# Altium project Rev4.PrjPcb
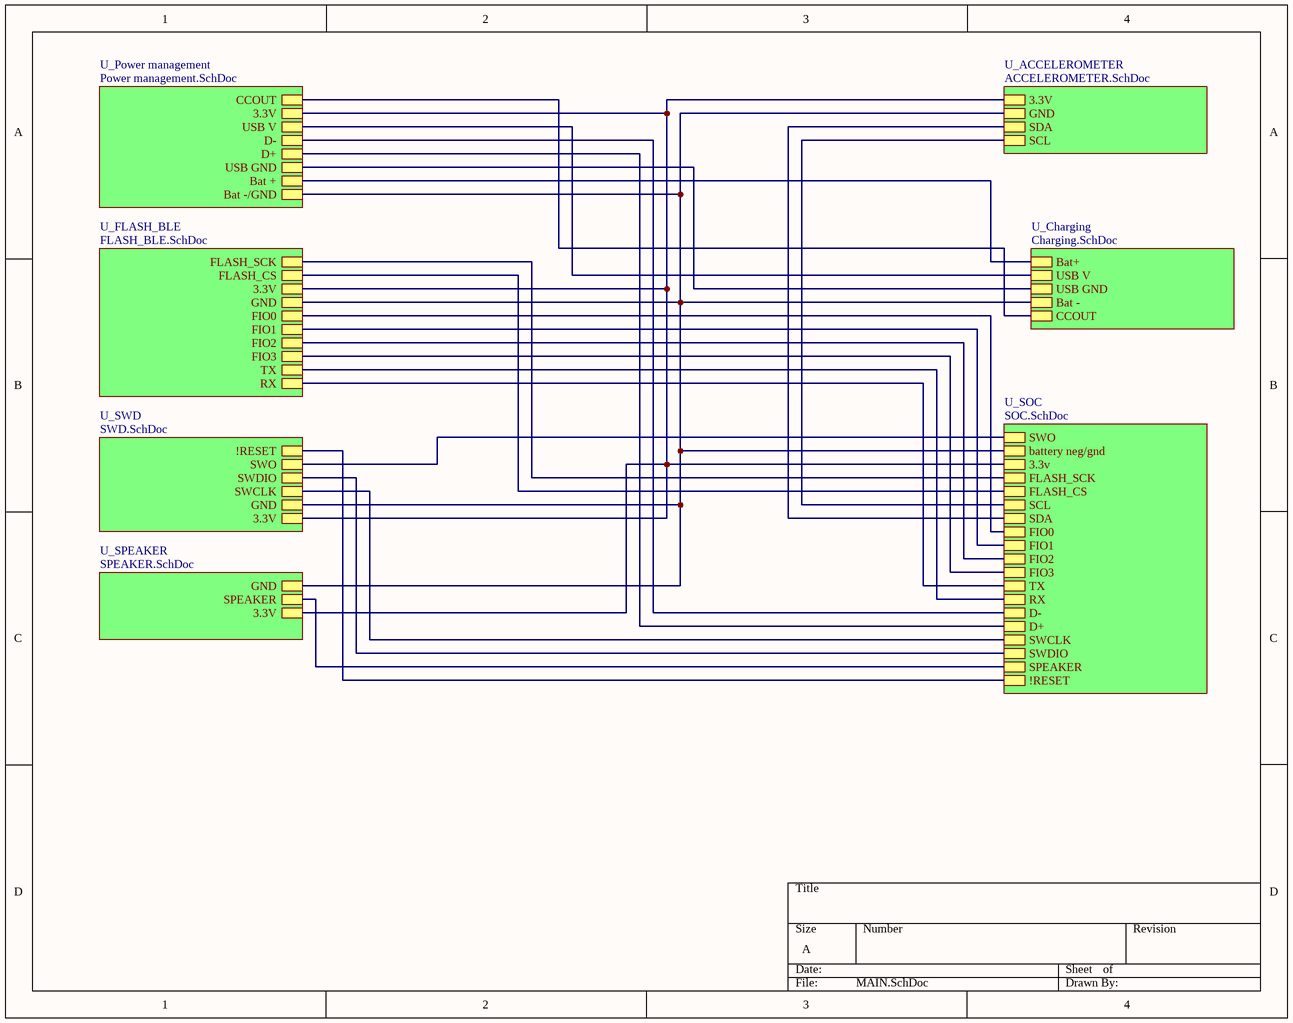
[diagram p0: MAIN.SchDoc]
8 sheets, 49 parts. Net scope: hierarchical (ports join the sheet entries above them; power ports are global).
Board file: PCB1.PcbDoc
Sheets:
  MAIN.SchDoc
    U_ACCELEROMETER = ACCELEROMETER.SchDoc
    U_SOC = SOC.SchDoc
    U_SWD = SWD.SchDoc
    U_SPEAKER = SPEAKER.SchDoc
    U_FLASH_BLE = FLASH_BLE.SchDoc
    U_Charging = Charging.SchDoc
    U_Power management = Power management.SchDoc

## Sheet MAIN.SchDoc
size A; SheetNumber: 1; SheetTotal: 8

### Sub-sheets
U_ACCELEROMETER = ACCELEROMETER.SchDoc: 3.3V, GND, SDA, SCL
U_Charging = Charging.SchDoc: Bat+, USB V, USB GND, Bat -, CCOUT
U_FLASH_BLE = FLASH_BLE.SchDoc: FLASH_SCK, FLASH_CS, 3.3V, GND, FIO0, FIO1, FIO2, FIO3, TX, RX
U_Power management = Power management.SchDoc: USB V, D-, D+, USB GND, Bat +, Bat -/GND, 3.3V, CCOUT
U_SOC = SOC.SchDoc: SWO, battery neg/gnd, 3.3v, FLASH_SCK, FLASH_CS, SCL, SDA, FIO0, FIO1, FIO2, FIO3, TX, RX, D-, D+, SWCLK, SWDIO, SPEAKER, !RESET
U_SPEAKER = SPEAKER.SchDoc: GND, SPEAKER, 3.3V
U_SWD = SWD.SchDoc: !RESET, SWO, SWDIO, SWCLK, GND, 3.3V

### Nets
Net3.3v_1: sheet U_Charging/CCOUT, sheet U_Power management/CCOUT
Net3.3v_3: sheet U_ACCELEROMETER/3.3V, sheet U_SOC/3.3v, sheet U_SWD/3.3V, sheet U_SPEAKER/3.3V, sheet U_FLASH_BLE/3.3V, sheet U_Power management/3.3V
Net3.3v_4: sheet U_ACCELEROMETER/GND, sheet U_SOC/battery neg/gnd, sheet U_SWD/GND, sheet U_SPEAKER/GND, sheet U_FLASH_BLE/GND, sheet U_Charging/USB GND, sheet U_Charging/Bat -, sheet U_Power management/USB GND, sheet U_Power management/Bat -/GND
NetAccelerometer?_23: sheet U_ACCELEROMETER/SCL, sheet U_SOC/SCL
NetAccelerometer?_24: sheet U_ACCELEROMETER/SDA, sheet U_SOC/SDA
NetBattery_Terminal_1: sheet U_Charging/Bat+, sheet U_Power management/Bat +
NetBLE_2: sheet U_SOC/RX, sheet U_FLASH_BLE/TX
NetBLE_4: sheet U_SOC/TX, sheet U_FLASH_BLE/RX
NetC11_2: sheet U_SOC/!RESET, sheet U_SWD/!RESET
NetCCC3_1: sheet U_Charging/USB V, sheet U_Power management/USB V
NetJ1_2: sheet U_SOC/SWDIO, sheet U_SWD/SWDIO
NetJ1_4: sheet U_SOC/SWCLK, sheet U_SWD/SWCLK
NetJ1_6: sheet U_SOC/SWO, sheet U_SWD/SWO
NetM4_17: sheet U_SOC/FIO0, sheet U_FLASH_BLE/FIO0
NetM4_18: sheet U_SOC/FIO1, sheet U_FLASH_BLE/FIO1
NetM4_19: sheet U_SOC/FIO2, sheet U_FLASH_BLE/FIO2
NetM4_20: sheet U_SOC/FIO3, sheet U_FLASH_BLE/FIO3
NetM4_23: sheet U_SOC/FLASH_SCK, sheet U_FLASH_BLE/FLASH_SCK
NetM4_24: sheet U_SOC/FLASH_CS, sheet U_FLASH_BLE/FLASH_CS
NetM4_25: sheet U_SOC/SPEAKER, sheet U_SPEAKER/SPEAKER
NetM4_45: sheet U_SOC/D-, sheet U_Power management/D-
NetM4_46: sheet U_SOC/D+, sheet U_Power management/D+

## Sheet ACCELEROMETER.SchDoc
size A; SheetNumber: 5; SheetTotal: 8
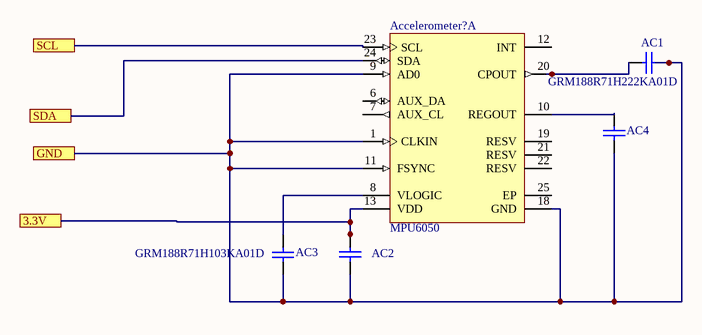
[diagram p1: ACCELEROMETER.SchDoc]

### Parts
AC1  GRM188R71H222KA01D  [CAPC1608X90X35NL10T15]
AC2  (no value)  [CAPC0805(2012)145_L]
AC3  GRM188R71H103KA01D  [CAPC1608X90X35ML10T15]
AC4  (no value)  [CAPC0805(2012)145_L]
Accelerometer?  MPU6050  [INSE-QFN-24_V]  (part A of 2)

### Ports
3.3V, GND, SCL, SDA

### Nets
Net3.3v_3: AC2.2 Accelerometer?.13(VDD) ; port 3.3V
Net3.3v_4: AC1.2 AC2.1 AC3.1 AC4.1 Accelerometer?.1(CLKIN) Accelerometer?.9(AD0) Accelerometer?.11(FSYNC) Accelerometer?.18(GND) ; port GND
NetAC1_1: AC1.1 Accelerometer?.20(CPOUT)
NetAC3_2: AC3.2 Accelerometer?.8(VLOGIC)
NetAC4_2: AC4.2 Accelerometer?.10(REGOUT)
NetAccelerometer?_23: Accelerometer?.23(SCL) ; port SCL
NetAccelerometer?_24: Accelerometer?.24(SDA) ; port SDA

Not connected (* = marked no-connect by the designer): Accelerometer? 6(AUX_DA) 7(AUX_CL) 12(INT) 19(RESV) 21(RESV) 22(RESV) 25(EP)

### Library data of the parts
AC1 = CMP-1662-00006-4: Chip Capacitor, 2.2 nF, +/- 10%, 50 V, -55 to 125 degC, 0603 (1608 Metric), RoHS, Tape and Reel; Manufacturer: Murata; Voltage Rating: 50 V; Pins: 2; Mount: Surface Mount; Max Operating Temperature: 125 degC; ComponentLink1Description: Manufacturer URL; RoHSCompliant: true; PackageDescription: 2-Pin Surface Mount Device, Body 1.6 x 0.8 mm; ComponentLink2URL: http://search.murata.co.jp/Ceramy/image/img/A01X/G101/ENG/GRM188R71H222KA01-01.pdf; PackageReference: 0603; Height: 0.8 mm; Lead Pitch: 4 mm; Packaging: Tape and Reel; DatasheetVersion: 02/2016; Mounting Technology: Surface Mount; ComponentLink2Description: Datasheet; Min Operating Temperature: -55 degC; Length: 1.6 mm; REACH SVHC: No SVHC; Package Quantity: 4000; ComponentLink1URL: http://www.murata.com/
AC2 AC4 = CMP-1036-04761-1: CAP 1uF 50V ±10% 0805 (2012 Metric) Thickness 1.45mm SMD; Tolerance: Â±10%; Case-EIA: 0805; Case-Metric: 2012; Technology: SMT; Value: 1uF; Max Thickness: 1.45 mm; Rated Voltage: 50 V
AC3 = CMP-2100-03642-1: Chip Capacitor, 10 nF, +/- 10%, 50 V, -55 to 125 degC, 0603 (1608 Metric), RoHS, Tape and Reel; Manufacturer: Murata; Insulation Resistance: 10GR; Dielectric: X7R; Voltage Rating: 50V; Capacitance: 10nF; Dielectric Material: Ceramic; Package Quantity: 1; Lead Free: LeadFree; Case/Package: 0603; Termination: SMD/SMT; REACH SVHC: Unknown; Manufacturer URL: http://www.murata.com/; Datasheet URL: http://search.murata.co.jp/Ceramy/image/img/A01X/G101/ENG/GRM188R71H103KA01-01.pdf; Mount: SurfaceMount; Datasheet Version: 42401.0; Number of Pins: 2; Length: 1.6mm; Voltage: 50V; Depth: 0.8mm; Tolerance: 10%; Min Operating Temperature: -55degC; Voltage Rating (DC): 50V; Max Operating Temperature: 125degC; Package Description: 2-Pin Surface Mount Device, Body 1.6 x 0.8 mm; RoHSCompliant: True; Case Code (Imperial): 0603; Width: 0.031inch; Case Code (Metric): 1608; Height: 0.8mm; Package Reference: 0603; Packaging: TapeandReel; Thickness: 0.035inch; Material: Ceramic
Accelerometer? = CMP-1753-00002-1: 3-Axis Gyroscope, 3-Axis Accelerometer / , 2.375 to 3.46 V, -40 to 105 degC, 24-Pin QFN, RoHS, Tape and Reel; Resistance: 5.6 kohm; Tolerance: 1%; Voltage Rating: 75 V; Power Rating: 100 mW; ComponentLink1Description: Manufacturer URL; Mount: Surface Mount; Max Operating Temperature: 155degC; Package Quantity: 5000; ComponentLink2Description: Datasheet; Pins: 2; Packaging: Tape and Reel; Case Code (Imperial): 0603; PackageReference: QFN-24; ComponentLink2URL: https://datasheet.ciiva.com/1513/1788002-1513632.pdf; Radiation Hardening: No; ComponentLink1URL: http://www.invensense.com/; PackageDescription: 24-Pin Quad Flat No-lead Package, Body 4 x 4 mm, Pitch 0.5 mm; Height: 0.45 mm; Case/Package: 0603; Case Code (Metric): 1608; REACH SVHC: Yes; Min Operating Temperature: -55degC; DatasheetVersion: Rev. 3.4, 08/2013; Width: 0.8 mm; RoHSCompliant: True; Length: 1.6 mm

## Sheet SOC.SchDoc
size A; SheetNumber: 2; SheetTotal: 8
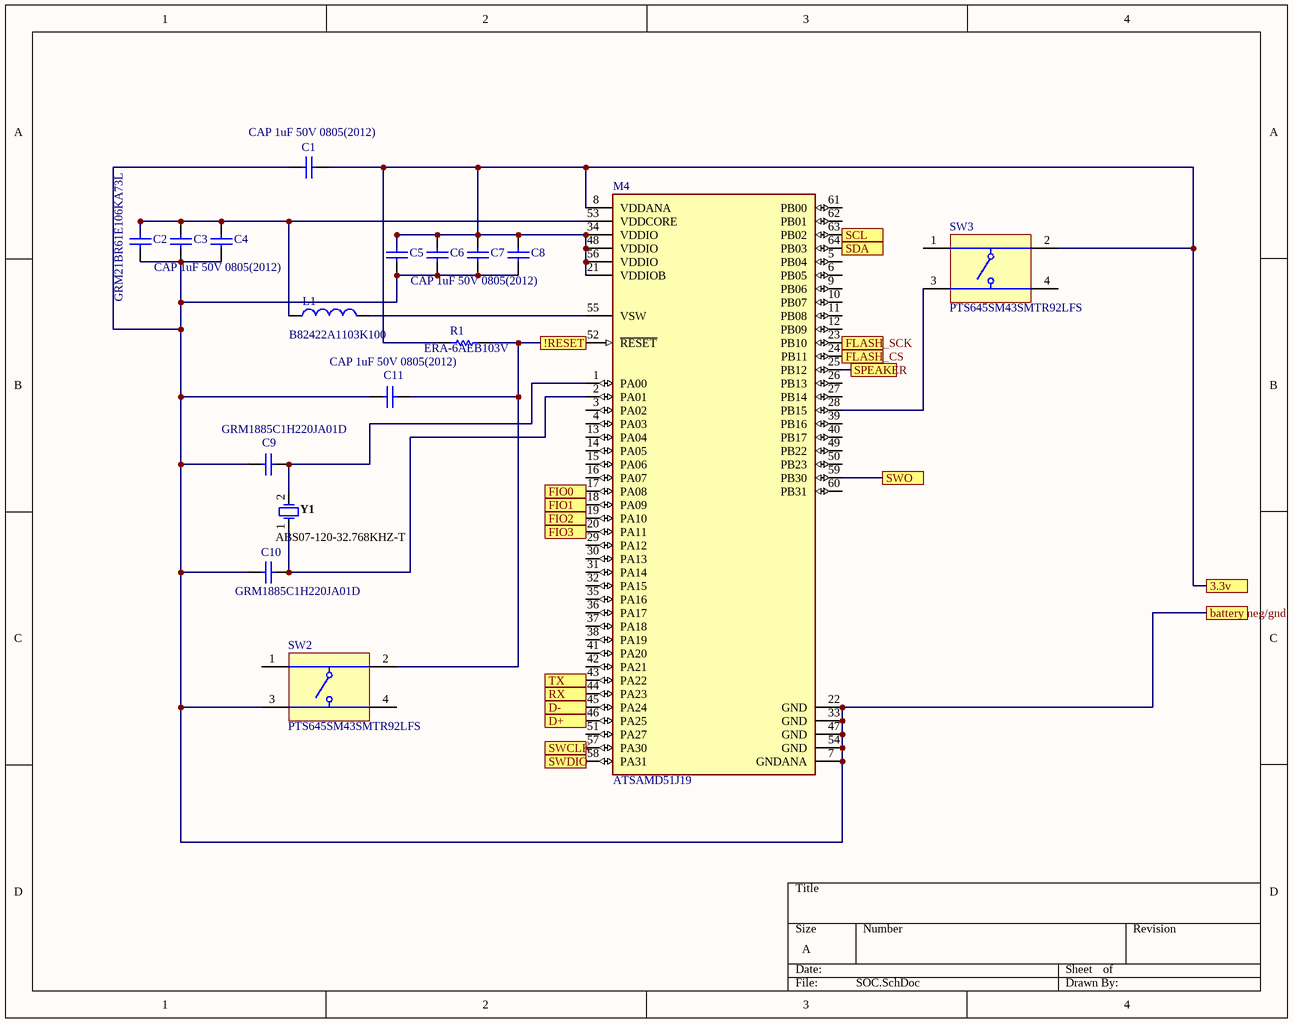
[diagram p2: SOC.SchDoc]

### Parts
C1  CAP 1uF 50V 0805(2012)  [CAPC0805(2012)145_L]
C2  GRM21BR61E106KA73L  [CAPC2013X135X45ML10T25]
C3  (no value)  [CAPC0805(2012)145_L]
C4  CAP 1uF 50V 0805(2012)  [CAPC0805(2012)145_L]
C5  (no value)  [CAPC0805(2012)145_L]
C6  (no value)  [CAPC0805(2012)145_L]
C7  (no value)  [CAPC0805(2012)145_L]
C8  CAP 1uF 50V 0805(2012)  [CAPC0805(2012)145_L]
C9  GRM1885C1H220JA01D  [CAPC1608X90X35ML10T15]
C10  GRM1885C1H220JA01D  [CAPC1608X90X35ML10T15]
C11  CAP 1uF 50V 0805(2012)  [CAPC0805(2012)145_L]
L1  B82422A1103K100  [TDK-B82422A1103K100_V]
M4  ATSAMD51J19  [FP-C04-085-MFG]
R1  ERA-6AEB103V  [RESC2013X60X40LL20T25_A]
SW2  PTS645SM43SMTR92LFS  [ITT-PTS645S-4_V]
SW3  PTS645SM43SMTR92LFS  [ITT-PTS645S-4_V]
Y1  ABS07-120-32.768KHZ-T  [ABRA-ABS07_A_V]

### Ports
3.3v, !RESET, battery neg/gnd, D+, D-, FIO0, FIO1, FIO2, FIO3, FLASH_CS, FLASH_SCK, RX, SCL, SDA, SPEAKER, SWCLK, SWDIO, SWO, TX

### Nets
Net3.3v_3: C1.2 C5.2 C6.2 C7.2 C8.2 M4.8(VDDANA) M4.21(VDDIOB) M4.34(VDDIO) M4.48(VDDIO) M4.56(VDDIO) R1.1 SW3.2 ; port 3.3v
Net3.3v_4: C1.1 C2.1 C3.1 C4.1 C5.1 C6.1 C7.1 C8.1 C9.1 C10.1 C11.1 M4.7(GNDANA) M4.22(GND) M4.33(GND) M4.47(GND) M4.54(GND) SW2.3 ; port battery neg/gnd
NetAccelerometer?_23: M4.63(PB02) ; port SCL
NetAccelerometer?_24: M4.64(PB03) ; port SDA
NetBLE_2: M4.44(PA23) ; port RX
NetBLE_4: M4.43(PA22) ; port TX
NetC2_2: C2.2 C3.2 C4.2 L1.1 M4.53(VDDCORE)
NetC9_2: C9.2 M4.1(PA00) Y1.2
NetC10_2: C10.2 M4.2(PA01) Y1.1
NetC11_2: C11.2 M4.52(~{RESET}) R1.2 SW2.2 ; port !RESET
NetJ1_2: M4.58(PA31) ; port SWDIO
NetJ1_4: M4.57(PA30) ; port SWCLK
NetJ1_6: M4.59(PB30) ; port SWO
NetL1_2: L1.2 M4.55(VSW)
NetM4_17: M4.17(PA08) ; port FIO0
NetM4_18: M4.18(PA09) ; port FIO1
NetM4_19: M4.19(PA10) ; port FIO2
NetM4_20: M4.20(PA11) ; port FIO3
NetM4_23: M4.23(PB10) ; port FLASH_SCK
NetM4_24: M4.24(PB11) ; port FLASH_CS
NetM4_25: M4.25(PB12) ; port SPEAKER
NetM4_28: M4.28(PB15) SW3.3
NetM4_45: M4.45(PA24) ; port D-
NetM4_46: M4.46(PA25) ; port D+

Not connected (* = marked no-connect by the designer): M4 3(PA02) 4(PA03) 5(PB04) 6(PB05) 9(PB06) 10(PB07) 11(PB08) 12(PB09) 13(PA04) 14(PA05) 15(PA06) 16(PA07) 26(PB13) 27(PB14) 29(PA12) 30(PA13) 31(PA14) 32(PA15) 35(PA16) 36(PA17) 37(PA18) 38(PA19) 39(PB16) 40(PB17) 41(PA20) 42(PA21) 49(PB22) 50(PB23) 51(PA27) 60(PB31) 61(PB00) 62(PB01); SW2 1 4; SW3 1 4

### Library data of the parts
C1 C3-C8 C11 = CMP-1036-04761-1: as AC2 on sheet ACCELEROMETER; Technology: SMT; Value: 1uF; Max Thickness: 1.45 mm; Rated Voltage: 50 V
C2 = CMP-2007-03541-1: Manufacturer: Murata; Part Number: GRM21BR61E106KA73L
C9 C10 = CMP-2000-04945-1: Chip Capacitor, 22 pF, +/- 5%, 50 V, -55 to 125 degC, 0603 (1608 Metric), RoHS, Tape and Reel; Manufacturer: Murata; Capacitance: 22pF; Rated Voltage: 50V; Dielectric: C0G; Manufacturer URL: http://www.murata.com/; Datasheet Version: Jul-06; Package Reference: 603; Tolerance (%): ±5%; Case Size/Dimension: 0603; Package Description: 2-Pin Surface Mount Device, Body 1.6 x 0.8 mm; Datasheet URL: https://datasheet.ciiva.com/11786/0900766b807a1cab-11786398.pdf
L1 = CMP-2000-05912-1: Wirewound Inductor, 10 uF, +/- 10%, 180 mA, -55 to 125 degC, 2-Pin SMD, RoHS, Tape and Reel; Manufacturer: EPCOS-(TDK); Frequency - Test: 1MHz; Current Rating: 180mA; Material - Core: Ferrite; Inductance: 10µH; DC Resistance (DCR): 1.6OhmMax; Q @ Freq: 27@2.52MHz; Frequency - Self Resonant: 25MHz; Shielding: Unshielded; Series: SIMID; Size / Dimension: 0.126"Lx0.098"W(3.20mmx2.50mm); Mounting Type: SurfaceMount; Current - Saturation: -; Operating Temperature: -; Datasheet URL: https://en.tdk.eu/inf/30/db/ind_2008/b82422a_100.pdf; Ratings: AEC-Q200; Category: Inductors,Coils,Chokes; Mounting Technology: SurfaceMount; Height - Seated (Max): 0.083"(2.10mm); Family: FixedInductors; Package / Case: 1210(3225Metric); Tolerance: ±10%; Manufacturer URL: http://www.tdk.com/; Datasheet Version: 10/2012; Type: Wirewound; Packaging: CutTape(CT); Package Description: 2-Pin Surface Mount Device, Body 3.2 x 2.5 mm; Package Reference: B82422A1103K100
M4 = CMP-06276-000034-1: IC MCU 32BIT 1MB FLASH 64TQFP; Manufacturer Part Number: ATSAMD51J20A-AU; Manufacturer: Microchip; Data Bus Width: 32bits; Number Of Adc Channels: 24; Nominal Supply Current: 7mA; Number Of I2C Channels: 6; Interface: I2C,SPI,USART,USB,LIN,Ethernet,I2S,RS-485,Other; Max Supply Voltage: 3.63V; Number Of I/Os: 51; Ram Size: 256KBytes; Memory Size: 1MBytes; Number Of Cores: 1; Max Junction Temp: +105°C; Standoff Height: 0.05mm; Automotive Grade: Grade 1; Frequency: 120MHz; Number Of Pwm Channels: 2; Core Architecture: ARM Cortex-M4F; Min Supply Voltage: 1.71V; Number Of Timers/Counters: 8; Device Class L1: Integrated Circuits (ICs); Device Class L2: Embedded Processors and Controllers; Mouser Description: MCU 32-bit ARM Cortex M4F RISC 1MB Flash 3.3V 64-Pin TQFP Tray; Height: 1.2mm; Package: C04-085; RoHS: TRUE; Automotive: Yes; Device Class L3: Microcontrollers; ComponentLink2URL: http://ww1.microchip.com/downloads/en/DeviceDoc/60001507E.pdf; Temperature: -40°C to +85°C; Ambient Temperature Range Low: -40°C; Temperature Range High: +85°C; Category: IC; Temperature Range Low: -40°C; Number Of Ethernet Channels: 1; Ambient Temperature Range High: +85°C; Octopart: https://octopart.com/atsamd51j20a-au-microchip-83497274; Digikey Description: IC MCU 32BIT 1MB FLASH 64TQFP; Number Of Usb Channels: 1; Number Of Spi Channels: 6; Memory Type: FLASH; ComponentLink2Description: Datasheet; Number Of A/D Converters: 2; Lead Free: Yes
R1 = CMP-2000-06228-1: Metal Film Chip Resistor, High Reliability Type, 0.125 W, +/- 0.1%, -55 to 155 degC, 0805 (2012 Metric), RoHS, Tape and Reel; Voltage Rating: 100V; Power Rating: 125mW(1/8W); Brand: Panasonic; Temperature Coefficient: 25PPM/C; Resistance: 10kOhms; Product Category: ThinFilmResistors-SMD; Datasheet Version: 02/2016; Operating Temperature Range: -55Cto+155C; Length: 2mm; Mounting Technology: SurfaceMount; Manufacturer URL: http://www.panasonic.com/; Width: 1.25mm; Packaging: Reel; Product: ThinFilmResistorsSMD; Package / Case: 0805(2012metric); Termination Style: SMD/SMT; Tolerance: 0.1%; Datasheet URL: https://industrial.panasonic.com/cdbs/www-data/pdf/RDM0000/AOA0000C307.pdf; Package Description: 2-Pin Surface Mount Device, Body 2 x 1.25 mm; Factory Pack Quantity: 5000; Series: ERA-6A; Case Code - mm: 2012; RoHS: Details; Package Reference: 0805; Height: 0.5mm; Manufacturer: Panasonic; Case Code - in: 0805; Type: MetalFilmChipResistors
SW2 SW3 = CMP-2000-05160-1: 6 mm Tact Switche, SPST, NO, -20 to 60 degC, 4-Pin SMT, RoHS, Tape and Reel; Manufacturer: ITT Cannon; Manufacturer URL: http://www.ittcannon.com/; Datasheet Version: Feb-14; Datasheet URL: https://datasheet.ciiva.com/29903/getdatasheetpartid-786341-29903846.pdf
Y1 = CMP-2000-07587-1: Tuning Fork Crystal, 32.768 KHz, +/- 20 ppm, -40 to 85 degC, 2-Pin SMD, RoHS, Tape and Reel; Manufacturer: Abracon; Case\/Package: SMD/SMT; Series Resistance: 60KOhm; Frequency Tolerance: 20ppm; Load Capacitance: 6pF; ESR (Equivalent Series Resistance): 55KOhm; Max Operating Temperature: 85degC; Width: 0.061inch; Radiation Hardening: No; Lead Free: LeadFree; RoHSCompliant: True; Depth: 1.5mm; Datasheet URL: http://www.abracon.com/Resonators/ABS07-120-32.768kHz-T.pdf; Frequency: 32.768KHz; Termination: SMD/SMT; Manufacturer URL: http://www.abracon.com/; Package Quantity: 3000; Packaging: TapeandReel; Number of Pins: 2; Height: 0.035inch; Package Description: 2-Pin Surface Mount Device, Body 3.2 x 1.5 mm; Package Reference: ABS07; Mount: SurfaceMount; Tolerance: 20ppm; Mounting Technology: SurfaceMount; REACH SVHC: NoSVHC; Datasheet Version: 11/2014; Length: 3.2mm; Min Operating Temperature: -40degC

## Sheet SWD.SchDoc
size A; SheetNumber: 7; SheetTotal: 8
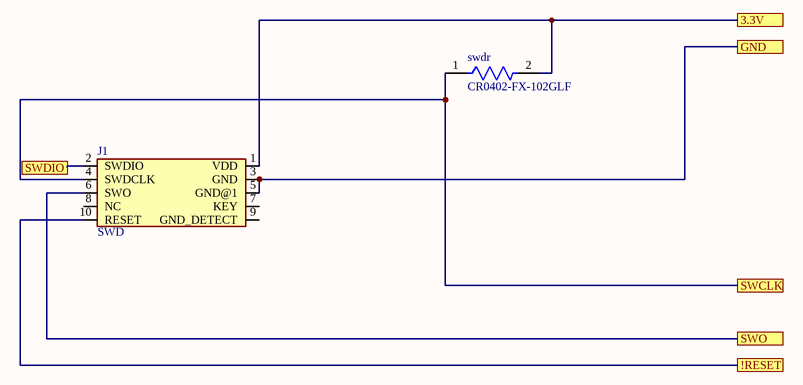
[diagram p3: SWD.SchDoc]

### Parts
J1  SWD  [2X10_BOXHEADER]
swdr  CR0402-FX-102GLF  [FP-CR0402-IPC_C]

### Ports
3.3V, !RESET, GND, SWCLK, SWDIO, SWO

### Nets
Net3.3v_3: J1.1(VDD) swdr.2 ; port 3.3V
Net3.3v_4: J1.3(GND) J1.5(GND@1) ; port GND
NetC11_2: J1.10(RESET) ; port !RESET
NetJ1_2: J1.2(SWDIO) ; port SWDIO
NetJ1_4: J1.4(SWDCLK) swdr.1 ; port SWCLK
NetJ1_6: J1.6(SWO) ; port SWO

Not connected (* = marked no-connect by the designer): J1 7(KEY) 8(NC) 9(GND_DETECT)

### Library data of the parts
J1 = SWD: SWD WRITEON W/DISP .75X1.4 LAB; MF: 3M; Price: None; Value: *; Package: None; SnapEDA_Link: https://www.snapeda.com/parts/SWD/3M%20%28TC%29/view-part/172681/?ref=snap; MP: SWD; Availability: Unavailable
swdr = CMP-2002-04703-2: Thick Film Chip Resistors 0402 1kΩ 0.0625W 1% 100ppm/°C; Voltage Rating: 50V; Max Power Dissipation: 63mW; Resistance: 1kR; Power Rating: 62.5mW; Package Quantity: 10000; Radiation Hardening: No; Temperature Coefficient: 100ppm/°C; Number of Terminations: 2; Packaging: Tape and Reel; Thickness: 356um; Case Code (Metric): 1005; Case/Package: 0402; Case Code (Imperial): 0402; Max Operating Temperature: 155°C; Composition: Thick Film; Min Operating Temperature: -55°C; Mount: Surface Mount; Tolerance: 1%; Termination: SMD/SMT; Width: 0.02inch; Contact Plating: Tin; Height: 0.016inch; Length: 0.039inch

## Sheet SPEAKER.SchDoc
size A; SheetNumber: 8; SheetTotal: 8
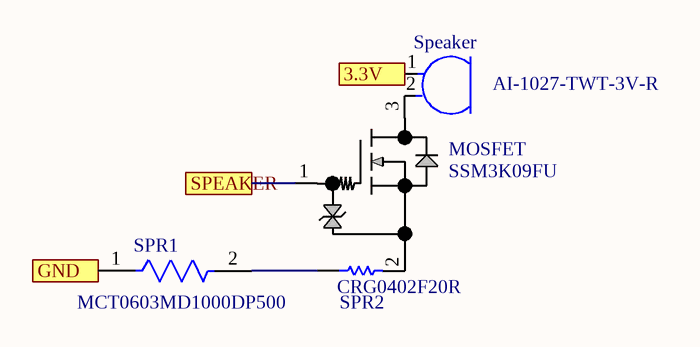
[diagram p4: SPEAKER.SchDoc]

### Parts
MOSFET  SSM3K09FU  [USM_TOS]
Speaker  AI-1027-TWT-3V-R  [FP-MA300D1-1-MFG]
SPR1  MCT0603MD1000DP500  [FP-MCT0603-MFG]
SPR2  CRG0402F20R  [RESC1005X40X25NL10T10]

### Ports
3.3V, GND, SPEAKER

### Nets
Net3.3v_3: Speaker.1 ; port 3.3V
Net3.3v_4: SPR1.1 ; port GND
NetM4_25: MOSFET.1 ; port SPEAKER
NetMOSFET_2: MOSFET.2 SPR2.2
NetMOSFET_3: MOSFET.3 Speaker.2
NetSPR1_2: SPR1.2 SPR2.1

### Library data of the parts
MOSFET = SSM3K09FU: No Description Available; Vendor: Toshiba; SourceLibrary: Toshiba_2018-12-14; Manufacturer_Part_Number: SSM3K09FU; Copyright: Copyright (C) 2018 Accelerated Designs. All rights reserved; RefDes: RefDes; Type: DEV
Speaker = CMP-06153-000004-1: Audio Indicators & Alerts 1300pF 300kHz Ultrasonic Sensor; Voltage Rating: 50V; Capacitance: 1.3nF; Frequency: 300kHz; Termination: Through Hole; Radiation Hardening: No; Package Quantity: 50; Number of Pins: 2; Max Operating Temperature: 70°C; Lead Free: Lead Free; Min Operating Temperature: -20°C; Mount: Flush
SPR1 = CMP-02407-007553-1: RES SMD 100 OHM 1% 1/8W 0603; Power Rating: 125mW; Max Power Dissipation: 150mW; Voltage Rating (DC): 75V; Temperature Coefficient: 25ppm/°C; Resistance: 100R; Tolerance: 0.5%; Features: Automotive AEC-Q200; Package Quantity: 1; Number of Terminations: 2; Weight: 7.1E-05oz; Case Code (Metric): 1608; REACH SVHC: No SVHC; Termination: SMD/SMT; Width: 0.8mm; Length: 0.061inch; Packaging: Tape and Reel; Case/Package: 0603; Height: 0.022inch; Min Operating Temperature: -55°C; Case Code (Imperial): 0603; Max Operating Temperature: 175°C; Voltage Rating: 75V; Composition: Thin Film
SPR2 = CMP-2002-05710-1: Manufacturer: TE Connectivity / AMP; Part Number: CRG0402F20R

## Sheet FLASH_BLE.SchDoc
size A; SheetNumber: 4; SheetTotal: 8
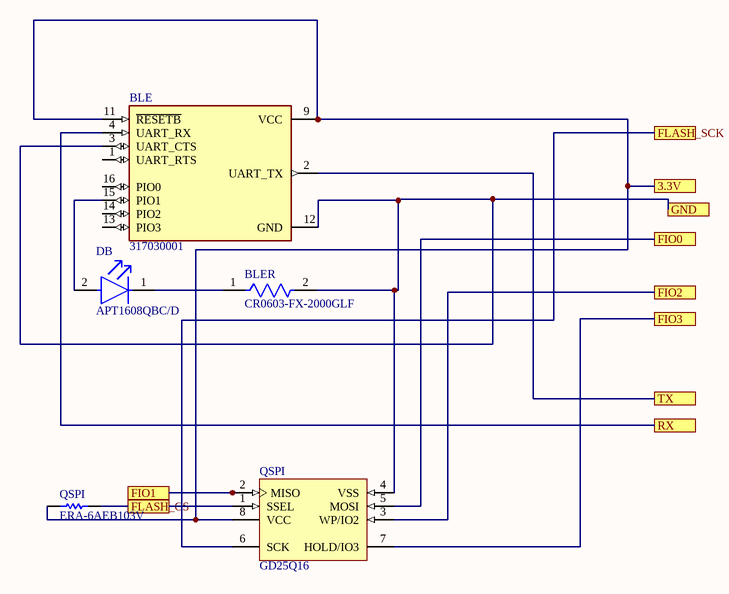
[diagram p5: FLASH_BLE.SchDoc]

### Parts
(Parts that share a designator on the sheet are numbered #1, #2 ... from top to bottom, then left to right.)
BLE  317030001  [XCVR_317030001]
BLER  CR0603-FX-2000GLF  [FP-CR0603-IPC_C]
DB  APT1608QBC/D  [FP-APT1608QBC-D-MFG]
QSPI#1  GD25Q16  [MICT-MN-8_N]
QSPI#2  ERA-6AEB103V  [RESC2013X60X40LL20T25_A]

### Ports
3.3V, FIO0, FIO1, FIO2, FIO3, FLASH_CS, FLASH_SCK, GND, RX, TX

### Nets
Net3.3v_3: BLE.9(VCC) BLE.11(~{RESETB}) QSPI#1.8(VCC) QSPI#2.1 ; port 3.3V
Net3.3v_4: BLE.3(UART_CTS) BLE.12(GND) BLER.2 QSPI#1.4(VSS) ; port GND
NetBLE_2: BLE.2(UART_TX) ; port TX
NetBLE_4: BLE.4(UART_RX) ; port RX
NetBLE_15: BLE.15(PIO1) DB.2(A)
NetBLER_1: BLER.1 DB.1(C)
NetM4_17: QSPI#1.5(MOSI) ; port FIO0
NetM4_18: QSPI#1.2(MISO) ; port FIO1
NetM4_19: QSPI#1.3(WP/IO2) ; port FIO2
NetM4_20: QSPI#1.7(HOLD/IO3) ; port FIO3
NetM4_23: QSPI#1.6(SCK) ; port FLASH_SCK
NetM4_24: QSPI#1.1(SSEL) QSPI#2.2 ; port FLASH_CS

Not connected (* = marked no-connect by the designer): BLE 1(UART_RTS) 13(PIO3) 14(PIO2) 16(PIO0)

### Library data of the parts
BLE = 317030001: Bluetooth Bluetooth v4.0 Transceiver Module 2.4GHz Integrated, Trace Surface Mount; MF: Seeed Technology; Value: *; SnapEDA_Link: https://www.snapeda.com/parts/317030001/Seeed%20Technology%20Co.%2C%20Ltd/view-part/449174/?ref=snap; Digi-Key_Purchase_URL: https://www.digikey.kr/product-detail/en/seeed-technology-co-ltd/317030001/1597-1359-ND/5487659?utm_source=snapeda&utm_medium=aggregator&utm_campaign=symbol; MP: 317030001; Digi-Key_Part_Number: 1597-1359-ND; Package: Module Seeed Technology
BLER = CMP-07231-003229-1: Thick Film Chip Resistors 0603 200Ω 0.1W 1% 100ppm/°C; Voltage Rating: 50V; Max Power Dissipation: 100mW; Resistance: 200R; Termination: SMD/SMT; Features: Moisture Resistant; Min Operating Temperature: -55°C; Height: 0.022inch; Depth: 0.8mm; Number of Terminations: 2; Packaging: Tape and Reel; Mount: Surface Mount; Width: 0.8mm; Case/Package: 0603; Max Operating Temperature: 155°C; Composition: Thick Film; Contact Plating: Tin; Length: 1.6mm; Tolerance: 1%; Military Standard: Not; Case Code (Imperial): 0603; Temperature Coefficient: 100ppm/°C; Power Rating: 100mW; Radiation Hardening: No; Case Code (Metric): 1608; Thickness: 457um; Package Quantity: 10000
DB = CMP-2000-05788-2: LED BLUE CLEAR CHIP SMD; Lens Style: Flat; Forward Current: 20mA; Luminous Intensity: 100mcd; Number of LEDs: 1; Dominant Wavelength: 465nm; Lens Color: Colorless; Forward Voltage: 3.3V; Viewing Angle: 120°; Case Code (Imperial): 0603; Number of Pins: 2; Length: 1.6mm; Mount: Surface Mount; Color: Blue; Width: 0.8mm; Height: 0.75mm; Case/Package: 0603; Lead Free: Lead Free; Case Code (Metric): 1608; Lens Transparency: Clear; Min Operating Temperature: -40°C; Packaging: Tape and Reel; Max Operating Temperature: 85°C; Package Quantity: 2000; Test Current: 20mA; Illumination Color: Blue
QSPI#1 = CMP-0357-00068-1: 1 Mb (x1) Serial NOR Flash Memory with Page Erase, 75 MHz, 2.7 to 3.6 V, 8-pin SO8 Narrow (MN), Tube; Part Family: M45PE; Manufacturer: Micron; PartNumber: M45PE10-VMN6P; Speed: 75 MHz; Voltage: 2.7V-3.6V; Density: 1Mb; PackageReference: MICT-MN-8; PackageDescription: 8-Pin SO Narrow, 3.9 X 4.9 mm, Pitch 1.27 mm; Part Status: Production; Mounting Technology: Surface Mount; ComponentLink2Description: Datasheet; ComponentLink1URL: http://www.micron.com/; DatasheetVersion: Rev. 8; ComponentLink1Description: Manufacturer URL; Type: Page Erase; Applications: Embedded; Width: x1; ComponentLink3URL: http://www.micron.com/~/media/Documents/Products/Data%20Sheet/NOR%20Flash/Serial%20NOR/M25P/M25P05A.pdf; RoHS: Yes; ComponentLink2URL: http://www.micron.com/~/media/Documents/Products/Data%20Sheet/NOR%20Flash/Serial%20NOR/M25PE_M45PE/M45PE10.pdf; Package: SO8 Narrow; ComponentLink3Description: Package Specification; PackageVersion: Rev 11
QSPI#2 = CMP-2001-00582-2: Metal Film Chip Resistor, High Reliability Type, 0.125 W, +/- 0.1%, -55 to 155 degC, 0805 (2012 Metric), RoHS, Tape and Reel; Voltage Rating: 100V; Power Rating: 125mW(1/8W); Brand: Panasonic; Temperature Coefficient: 25PPM/C; Resistance: 10kOhms; Product Category: ThinFilmResistors-SMD; Datasheet Version: 02/2016; Operating Temperature Range: -55Cto+155C; Length: 2mm; Mounting Technology: SurfaceMount; Manufacturer URL: http://www.panasonic.com/; Width: 1.25mm; Packaging: Reel; Product: ThinFilmResistorsSMD; Package / Case: 0805(2012metric); Termination Style: SMD/SMT; Tolerance: 0.1%; Datasheet URL: https://industrial.panasonic.com/cdbs/www-data/pdf/RDM0000/AOA0000C307.pdf; Package Description: 2-Pin Surface Mount Device, Body 2 x 1.25 mm; Factory Pack Quantity: 5000; Series: ERA-6A; Case Code - mm: 2012; RoHS: Details; Package Reference: 0805; Height: 0.5mm; Manufacturer: Panasonic; Case Code - in: 0805; Type: MetalFilmChipResistors

## Sheet Charging.SchDoc
size A; SheetNumber: 6; SheetTotal: 8
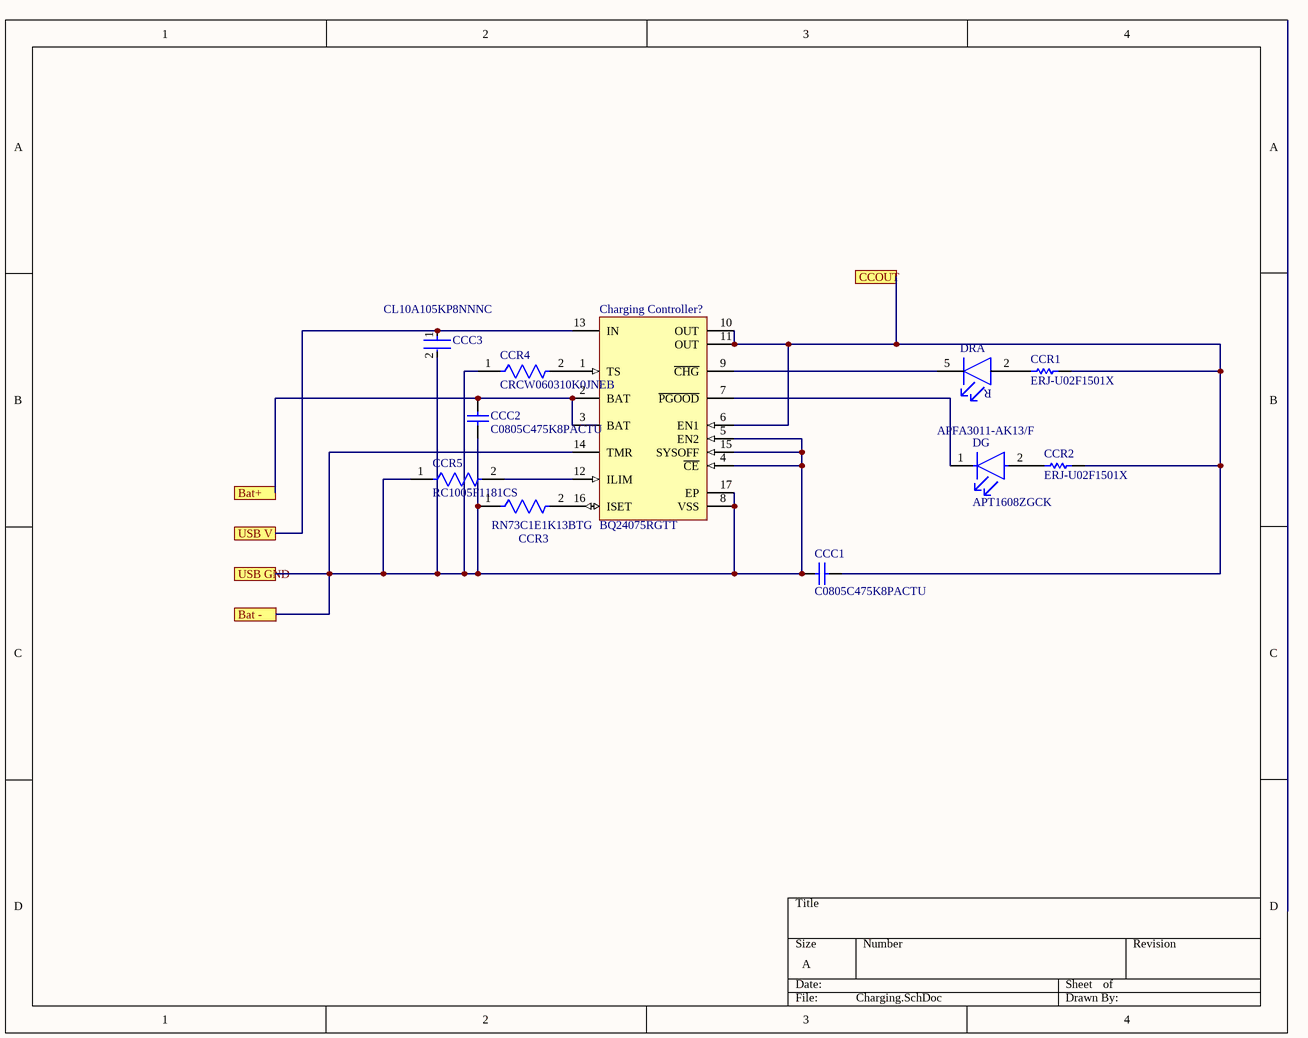
[diagram p6: Charging.SchDoc]

### Parts
CCC1  C0805C475K8PACTU  [CAPC2013X145X50ML20T25]
CCC2  C0805C475K8PACTU  [CAPC2013X145X50ML20T25]
CCC3  CL10A105KP8NNNC  [FP-CL10-IPC_C]
CCR1  ERJ-U02F1501X  [RESC1005X40X25NL05T10]
CCR2  ERJ-U02F1501X  [RESC1005X40X25NL05T10]
CCR3  RN73C1E1K13BTG  [FP-RN731E-MFG]
CCR4  CRCW060310K0JNEB  [FP-CRCW0603-e3-IPC_B]
CCR5  RC1005F1181CS  [FP-RC1005-IPC_A]
Charging_Controller?  BQ24075RGTT  [RGT0016C_V]
DG  APT1608ZGCK  [FP-APT1608ZGCK-MFG]
DR  APFA3011-AK13/F  [FP-APFA3011-AK13-F-MFG]  (part A of 3)

### Ports
Bat -, Bat+, CCOUT, USB GND, USB V

### Nets
Net3.3v_1: CCC1.2 CCR1.2 CCR2.2 Charging_Controller?.6(EN1) Charging_Controller?.10(OUT) Charging_Controller?.11(OUT) ; port CCOUT
Net3.3v_4: CCC1.1 CCC2.1 CCC3.2 CCR3.1 CCR4.1 CCR5.1 Charging_Controller?.4(~{CE}) Charging_Controller?.5(EN2) Charging_Controller?.8(VSS) Charging_Controller?.14(TMR) Charging_Controller?.15(SYSOFF) Charging_Controller?.17(EP) ; port USB GND, port Bat -
NetBattery_Terminal_1: CCC2.2 Charging_Controller?.2(BAT) Charging_Controller?.3(BAT) ; port Bat+
NetCCC3_1: CCC3.1 Charging_Controller?.13(IN) ; port USB V
NetCCR1_1: CCR1.1 DR.2(Red_A)
NetCCR2_1: CCR2.1 DG.2(A)
NetCCR3_2: CCR3.2 Charging_Controller?.16(ISET)
NetCCR4_2: CCR4.2 Charging_Controller?.1(TS)
NetCCR5_2: CCR5.2 Charging_Controller?.12(ILIM)
NetCharging_Controller?_7: Charging_Controller?.7(~{PGOOD}) DG.1(C)
NetCharging_Controller?_9: Charging_Controller?.9(~{CHG}) DR.5(Red_C)

### Notes on the sheet
- (in symbol CMP-44529-000011-1, part A) R

### Library data of the parts
CCC1 CCC2 = CMP-2007-01007-1: Manufacturer: Kemet; Part Number: C0805C475K8PACTU
CCC3 = CMP-13271-003399-1: Cap Ceramic 1uF 10V X5R ±10% Pad SMD 0603 +85°C T/R; Min Operating Temperature: -55°C; Max Operating Temperature: 85°C; Dielectric: X5R; Contact Plating: Tin; Height: 0.8mm; Voltage: 10V; Packaging: Tape and Reel; Voltage Rating: 10V; Capacitance: 1uF; Package Quantity: 1; Width: 0.031inch; Length: 1.6mm; Depth: 0.8mm; Case/Package: 0603; Case Code (Imperial): 0603; Thickness: 0.035inch; Radiation Hardening: No; Tolerance: 10%; Case Code (Metric): 1608; Mount: Surface Mount
CCR1 CCR2 = CMP-2002-06462-1: Manufacturer: Panasonic; Part Number: ERJ-U02F1501X
CCR3 = CMP-03211-004648-1: Res Thin Film 0402 1.13KΩ 0.1% 1/16W 10ppm/°C Molded SMD; Manufacturer: TE Connectivity; Voltage Rating: 25V; Power Rating: 0.063W; Octopart: https://octopart.com/rn73c1e1k13btg-te+connectivity-42626925; Temperature Coefficient: 10ppm/°C; Resistance: 1.13KΩ; packaging: 250 cut tape length; Series: RN73; Tolerance: 0.1%; Composition: Thin Film; ComponentLink2URL: https://www.te.com/commerce/DocumentDelivery/DDEController?Action=showdoc&DocId=Data+Sheet%7F1773270%7FP%7Fpdf%7FEnglish%7FENG_DS_1773270_P.pdf%7F1-1879132-6; Temperature Range High: +155°C; Temperature: -55°C to +155°C; octopart_url: https://octopart.com/rn73c1e1k13btg-te+connectivity-42626925; Automotive: No; RoHS: TRUE; Height: 0.35mm; Device Class L3: Chip SMD Resistors; Device Class L1: Passive Components; Device Class L2: Resistors; Package: RN731E; Value: 1.13KΩ; Category: Res; Manufacturer Part Number: RN73C1E1K13BTG; Temperature Range Low: -55°C; Lead Free: Yes; Ipc Land Pattern Name: RESC10050X30; ComponentLink2Description: Datasheet
CCR4 = CMP-2000-03839-2: RES Thick Film, 10kΩ, 5%, 0.1W, 200ppm/°C, 0603; Resistance: 10kR; Max Power Dissipation: 100mW; Voltage Rating: 75V; Tolerance: 5%; Weight: 7.1E-05oz; Packaging: Tape and Reel; Length: 1.55mm; Case/Package: 0603; Radiation Hardening: No; Military Standard: Not; Package Quantity: 10000; Depth: 0.85mm; Temperature Coefficient: 200ppm/°C; Width: 0.85mm; Min Operating Temperature: -55°C; Max Operating Temperature: 155°C; Composition: Thick Film; Termination: SMD/SMT; Features: Automotive AEC-Q200; Number of Terminations: 2; Contact Plating: Tin; Case Code (Imperial): 0603; Height: 0.02inch; Power Rating: 100mW; Lead Free: Lead Free; Voltage Rating (DC): 75V; Case Code (Metric): 1608
CCR5 = CMP-13261-002895-1: Res Thick Film 0402 1.18kΩ 1% 0.063W ±100ppm/°C Molded SMD T/R; Voltage Rating (DC): 50V; Max Power Dissipation: 63mW; Resistance: 1.18kR; Tolerance: 1%; Features: Moisture Resistant; Packaging: Tape and Reel; Number of Terminations: 2; Case Code (Metric): 1005; Height: 0.016inch; Power Rating: 63mW; Case Code (Imperial): 0402; Max Operating Temperature: 155°C; Package Quantity: 1; Min Operating Temperature: -55°C; Temperature Coefficient: 100ppm/°C; Depth: 0.5mm; Length: 1mm; Width: 0.02inch; Composition: Thick Film; Case/Package: 0402; Lead Free: Lead Free; Military Standard: Not
Charging_Controller? = CMP-0321-00236-2: USB-Friendly Li-Ion Battery Charger and Power-Path Management IC, Vout 5.5 V, 4.3 V, -40 to 85 degC, 16-pin QFN (RGT), Green (RoHS & no Sb/Br); Manufacturer: Texas Instruments; Vin(Min)(V): 4.3; SubFamily: Battery Charge Management; NiMH: N; PackageDescription: 16-Pin Plastic Quad Flat No-Lead, 3 x 3 mm Body, 0.5 mm Pitch, 1.7 x 1.7 mm Exposed Pad; PartNumber: BQ24075RGTT; PackageVersion: revH, Oct-2011; Eco-Plan: Green (RoHS & no Sb/Br); Code_JEDEC: MO-220; ComponentLink1Description: Datasheet; PackageReference: RGT0016C; NiCd: N; Li-Polymer: N; DatasheetVersion: SLUS810G; ComponentLink1URL: http://www.ti.com/general/docs/lit/getliterature.tsp?genericPartNumber=BQ24075&fileType=pdf; Over Voltage Protection: N; Mounting Technology: Surface Mount; Lead Acid: N; Li-Ion: N
DG = CMP-44529-000024-1: LED GREEN CLEAR CHIP SMD; Forward Voltage: 3.3V; Dominant Wavelength: 525nm; Forward Current: 20mA; Lens Color: Colorless; Viewing Angle: 120°; Luminous Intensity: 350mcd; Lens Transparency: Clear; Color: Green; Max Operating Temperature: 85°C; Case/Package: 0603; Mount: Surface Mount; Min Operating Temperature: -40°C; Case Code (Metric): 1608; Test Current: 20mA; Packaging: Tape and Reel; Width: 0.8mm; Package Quantity: 1; Height: 0.75mm; Length: 1.6mm; Illumination Color: Green; Lead Free: Lead Free; Case Code (Imperial): 0603
DR = CMP-44529-000011-1: LED RGB CLEAR 4SMD R/A; Manufacturer: Kingbright; Forward Current: 20mA; Power Dissipation: 120/120/84mW; Max Junction Temp: +115°C; Led Orientation: Side View; Peak Emmision Wavelength: 465/520/640nm; Forward Voltage: 3.3/3.2/2.2V; Reverse Voltage: 5V; Luminous Intensity: 150/780/410mcd; Viewing Angle: 150°; Wavelength: 470/525/625nm; Package: 0; RoHS: TRUE; Manufacturer Part Number: APFA3011-AK13/F; Digikey Description: LED RGB CLEAR 4SMD R/A; Temperature: -40°C to +85°C; Device Class L1: Optoelectronics; Octopart: https://octopart.com/apfa3011-ak13%2Ff-kingbright-85376835; Device Class L2: LEDs; Temperature Range High: +85°C; Colour: Blue, Green, Red; Height: 1.2mm; Automotive: No; Temperature Range Low: -40°C; Device Class L3: unset; ComponentLink2URL: https://www.kingbrightusa.com/images/catalog/SPEC/APFA3011-AK13-F.pdf; ComponentLink2Description: Datasheet; Lead Free: Yes; Category: Diode; Mouser Description: Led Rgb Clear 4SMD R/a

## Sheet Power management.SchDoc
size A; SheetNumber: 3; SheetTotal: 8
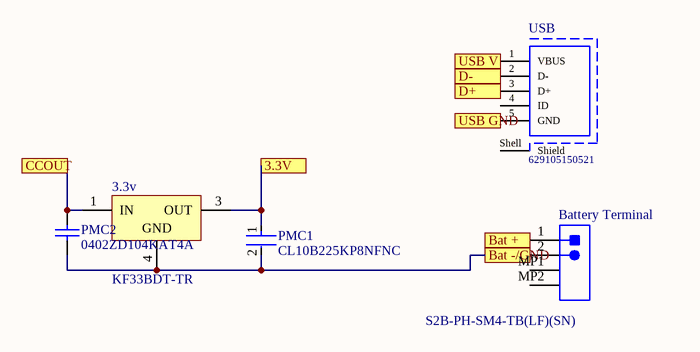
[diagram p7: Power management.SchDoc]

### Parts
3.3v  KF33BDT-TR  [TO-252_L]
Battery_Terminal  S2B-PH-SM4-TB(LF)(SN)  [JST- S2B-PH-SM4-TB(LF)(SN)-2_V]
PMC1  CL10B225KP8NFNC  [FP-CL10-IPC_A]
PMC2  0402ZD104KAT4A  [CAPC1005X56X25ML10T15]
USB  629105150521  [629105150521]

### Ports
3.3V, Bat +, Bat -/GND, CCOUT, D+, D-, USB GND, USB V

### Nets
Net3.3v_1: 3.3v.1(IN) PMC2.2 ; port CCOUT
Net3.3v_3: 3.3v.3(OUT) PMC1.1 ; port 3.3V
Net3.3v_4: 3.3v.4(GND) Battery_Terminal.2 PMC1.2 PMC2.1 USB.5(GND) ; port USB GND, port Bat -/GND
NetBattery_Terminal_1: Battery_Terminal.1 ; port Bat +
NetCCC3_1: USB.1(VBUS) ; port USB V
NetM4_45: USB.2(D-) ; port D-
NetM4_46: USB.3(D+) ; port D+

Not connected (* = marked no-connect by the designer): Battery_Terminal MP1 MP2; USB 4(ID) Shell(Shield)

### Library data of the parts
3.3v = CMP-0244-00072-1: Very Low Drop Voltage Regulators with Inhibit, 3.3V, 3-Pin DPAK, Tape and Reel; DatasheetVersion: 21/02/2008; ComponentLink2Description: Datasheet; ComponentLink1URL: http://www.st.com; PackageVersion: 2011; ComponentLink1Description: Manufacturer URL; PackageDescription: 3-Pin Transistor Outline Package 2.28 mm Pitch, 9.7 mm Lead Span (DPAK); ComponentLink2URL: http://www.st.com/internet/com/TECHNICAL_RESOURCES/TECHNICAL_LITERATURE/DATASHEET/CD00000970.pdf; PackageReference: TO-252
Battery_Terminal = CMP-1755-00001-1: Male Header, Pitch 2 mm, 1 x 2 Position, Height 5.5 mm, -25 to 85 degC, RoHS, Tape and Reel; Current Rating: 3 A; ComponentLink1URL: http://www.jst.com/home2.html; Radiation Hardening: No; RoHSCompliant: True; Mount: Through Hole; Contact Material: Bronze; Package Quantity: 100; Width: 2.34 mm; DatasheetVersion: Dec-12; Height: 8.13 mm; Max Operating Temperature: 105degC; ComponentLink2Description: Datasheet; Lead Pitch: 0.1 inch; Contact Finish: Lead; Packaging: Bulk; Colour: Black; Contact Plating: Tin; Min Operating Temperature: -65degC; ComponentLink1Description: Manufacturer URL; PackageReference: S2B-PH-SM4-TB(LF)(SN)-2; PackageDescription: Male Header, Pitch 2 mm, 1 x 2 Position, Height 5.5 mm; ComponentLink2URL: http://www.jst-mfg.com/product/pdf/eng/ePH.pdf; Pins: 40; Length: 101.19 mm
PMC1 = CMP-13271-000561-1: Cap Ceramic 2.2uF 10V X7R ±10% Pad SMD 0603 +125°C T/R; Thickness: 0.035inch; Radiation Hardening: No; Voltage Rating: 10V; Min Operating Temperature: -55°C; Case Code (Imperial): 0603; Mount: Surface Mount; Dielectric: X7R; Case Code (Metric): 1608; Package Quantity: 1; Width: 0.031inch; Case/Package: 0603; Height: 0.8mm; Depth: 0.8mm; Capacitance: 2.2uF; Max Operating Temperature: 125°C; Packaging: Tape and Reel; Length: 0.063inch; Tolerance: 10%
PMC2 = CMP-2008-02879-1: Manufacturer: AVX Interconnect / Elco; Part Number: 0402ZD104KAT4A
USB = CMP-1502-03252-1: Micro USB 2.0 Type B Receptacle WR-COM, Horizontal, SMT, with Pegs, High Current at Pin 1 & Pin 5; Manufacturer: Wurth Elektronik; Contact Resistance: 30mOhm; Rated Current: 3A; Working Voltage: 30VAC; Package Reference: 629105150521; Mounting Technology: SMT; Connector Type: MicroUSB2.0TypeB; Operating Temperature: -40to85degC; Orientation: Horizontal; Manufacturer URL: http://www.we-online.de; Datasheet URL: https://katalog.we-online.de/em/datasheet/629105150521.pdf; Part Number: 629105150521; Packaging: TapeandReel; Gender: Receptacle; Publisher: WurthElektronik

## Nets that join several sheets
Net3.3v_1: Charging (6 pins), Power management (3.3v.1 PMC2.2)
Net3.3v_3: ACCELEROMETER (AC2.2 Accelerometer?.13), SOC (12 pins), SWD (J1.1 swdr.2), SPEAKER (Speaker.1), FLASH_BLE (BLE.9 BLE.11 QSPI#1.8 QSPI#2.1), Power management (3.3v.3 PMC1.1)
Net3.3v_4: ACCELEROMETER (8 pins), SOC (17 pins), SWD (J1.3 J1.5), SPEAKER (SPR1.1), FLASH_BLE (BLE.3 BLE.12 BLER.2 QSPI#1.4), Charging (12 pins), Power management (5 pins)
NetAccelerometer?_23: ACCELEROMETER (Accelerometer?.23), SOC (M4.63)
NetAccelerometer?_24: ACCELEROMETER (Accelerometer?.24), SOC (M4.64)
NetBattery_Terminal_1: Charging (CCC2.2 Charging_Controller?.2 Charging_Controller?.3), Power management (Battery_Terminal.1)
NetBLE_2: SOC (M4.44), FLASH_BLE (BLE.2)
NetBLE_4: SOC (M4.43), FLASH_BLE (BLE.4)
NetC11_2: SOC (C11.2 M4.52 R1.2 SW2.2), SWD (J1.10)
NetCCC3_1: Charging (CCC3.1 Charging_Controller?.13), Power management (USB.1)
NetJ1_2: SOC (M4.58), SWD (J1.2)
NetJ1_4: SOC (M4.57), SWD (J1.4 swdr.1)
NetJ1_6: SOC (M4.59), SWD (J1.6)
NetM4_17: SOC (M4.17), FLASH_BLE (QSPI#1.5)
NetM4_18: SOC (M4.18), FLASH_BLE (QSPI#1.2)
NetM4_19: SOC (M4.19), FLASH_BLE (QSPI#1.3)
NetM4_20: SOC (M4.20), FLASH_BLE (QSPI#1.7)
NetM4_23: SOC (M4.23), FLASH_BLE (QSPI#1.6)
NetM4_24: SOC (M4.24), FLASH_BLE (QSPI#1.1 QSPI#2.2)
NetM4_25: SOC (M4.25), SPEAKER (MOSFET.1)
NetM4_45: SOC (M4.45), Power management (USB.2)
NetM4_46: SOC (M4.46), Power management (USB.3)